# EAGLE design M452sx (EAGLE 6.6.0)
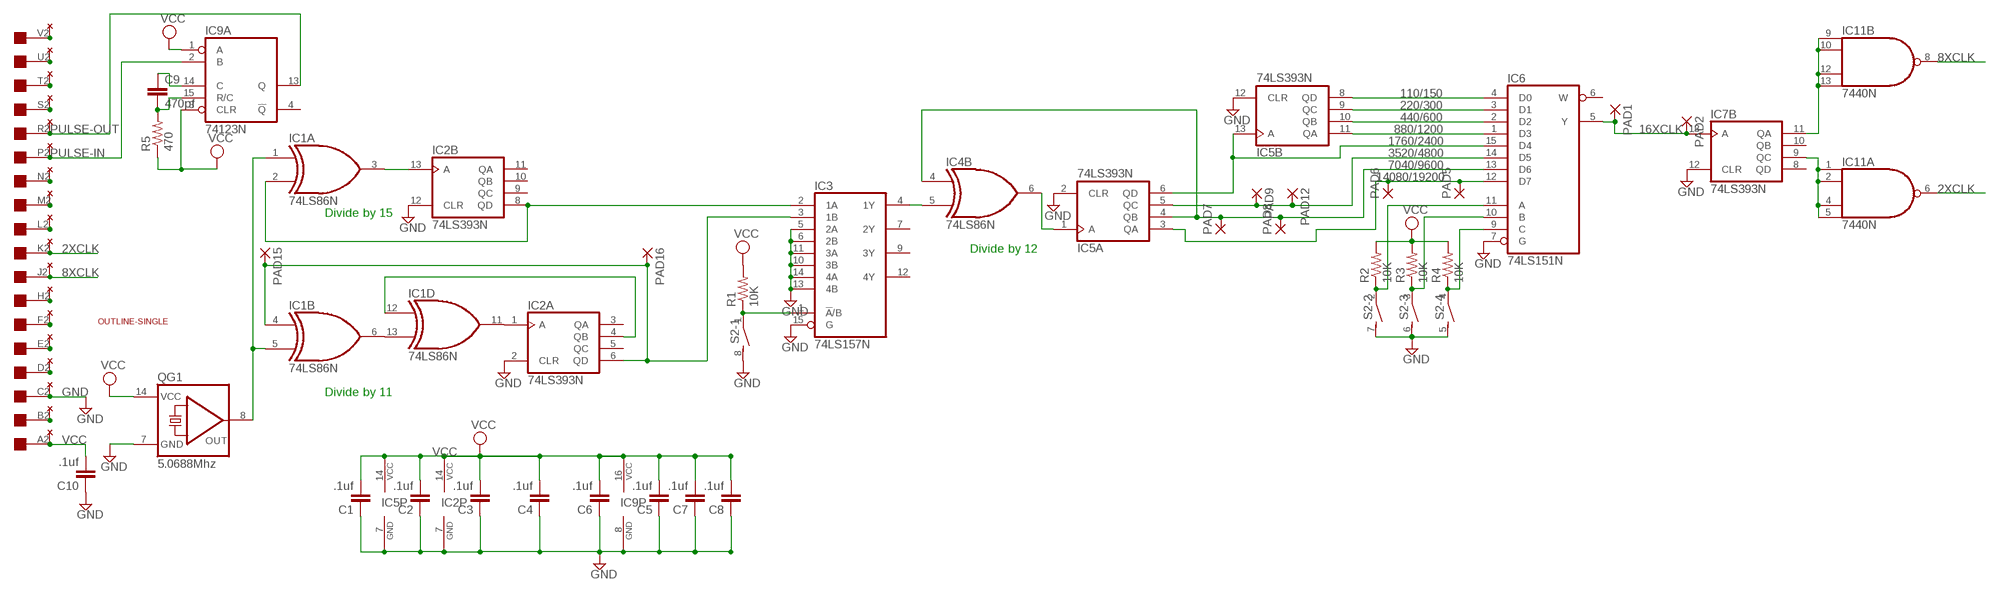
[diagram p0: schematic, sheet 1]

## Parts
C1  .1uf  C-EU050-025X075  [C050-025X075]
C2  .1uf  C-EU050-025X075  [C050-025X075]
C3  .1uf  C-EU050-025X075  [C050-025X075]
C4  .1uf  C-EU050-025X075  [C050-025X075]
C5  .1uf  C-EU050-025X075  [C050-025X075]
C6  .1uf  C-EU050-025X075  [C050-025X075]
C7  .1uf  C-EU050-025X075  [C050-025X075]
C8  .1uf  C-EU050-025X075  [C050-025X075]
C9  470pf  C-EU050-025X075  [C050-025X075]
C10  .1uf  C-EU050-025X075  [C050-025X075]
IC1  74LS86N  [DIL14]
IC2  74LS393N  [DIL14]
IC3  74LS157N  [DIL16]
IC4  74LS86N  [DIL14]
IC5  74LS393N  [DIL14]
IC6  74LS151N  74151N  [DIL16]
IC7  74LS393N  [DIL14]
IC9  74123N  [DIL16]
IC11  7440N  74S20N  [DIL14]
PAD1  1,6/0,8  [1,6/0,8]
PAD2  1,6/0,8  [1,6/0,8]
PAD5  1,6/0,8  [1,6/0,8]
PAD6  1,6/0,8  [1,6/0,8]
PAD7  1,6/0,8  [1,6/0,8]
PAD8  1,6/0,8  [1,6/0,8]
PAD9  1,6/0,8  [1,6/0,8]
PAD12  1,6/0,8  [1,6/0,8]
PAD15  1,6/0,8  [1,6/0,8]
PAD16  1,6/0,8  [1,6/0,8]
QG1  5.0688Mhz  QG5860  [DIL14S]
R1  10K  R-US_0204/7  [0204/7]
R2  10K  R-US_0204/7  [0204/7]
R3  10K  R-US_0204/7  [0204/7]
R4  10K  R-US_0204/7  [0204/7]
R5  470  R-US_0204/7  [0204/7]
S2  DIP04S  [DIP04S]
U$2  EDGE-1  [EDGE-CON1]
U$3  THRU-HOLE1  [THRU-HOLE1]
U$4  OUTLINE-SINGLE  [SINGLE]

## Nets
2XCLK: IC11.6(A:O) U$2.K2 U$3.K2
8XCLK: IC11.8(B:O) U$2.J2 U$3.J2
16XCLK: IC6.5(Y) IC7.13(B:A) PAD1.1(P) PAD2.1(P)
110/150: IC5.8(B:QD) IC6.4(D0)
220/300: IC5.9(B:QC) IC6.3(D1)
440/600: IC5.10(B:QB) IC6.2(D2)
880/1200: IC5.11(B:QA) IC6.1(D3)
1760/2400: IC5.6(A:QD) IC5.13(B:A) IC6.15(D4)
3520/4800: IC5.5(A:QC) IC6.14(D5) PAD9.1(P) PAD12.1(P)
7040/9600: IC4.4(B:I0) IC5.4(A:QB) IC6.13(D6) PAD7.1(P) PAD8.1(P)
14080/19200: IC5.3(A:QA) IC6.12(D7) PAD5.1(P) PAD6.1(P)
GND: C1.1 C2.1 C3.1 C4.1 C5.1 C6.1 C7.1 C8.1 C10.1 IC2.2(A:CLR) IC2.7(P:GND) IC2.12(B:CLR) IC3.5(2A) IC3.6(2B) IC3.10(3B) IC3.11(3A) IC3.13(4B) IC3.14(4A) IC3.15(G) IC5.2(A:CLR) IC5.7(P:GND) IC5.12(B:CLR) IC6.7(G) IC7.12(B:CLR) IC9.8(P:GND) QG1.7(GND) S2.5 S2.6 S2.7 S2.8 U$2.C2 U$3.C2
N$1: IC1.1(A:I0) IC1.5(B:I1) QG1.8(OUT)
N$2: IC1.2(A:I1) IC2.8(B:QD) IC3.2(1A)
N$3: IC1.4(B:I0) IC2.6(A:QD) IC3.3(1B) PAD15.1(P) PAD16.1(P)
N$4: U$2.V2 U$3.V2
N$5: U$2.U2 U$3.U2
N$6: IC1.3(A:O) IC2.13(B:A)
N$7: IC1.11(D:O) IC2.1(A:A)
N$8: IC6.11(A) R2.1 S2.2
N$9: IC3.4(1Y) IC4.5(B:I1)
N$10: IC7.9(B:QC) IC11.1(A:I0) IC11.2(A:I1) IC11.4(A:I2) IC11.5(A:I3)
N$11: IC4.6(B:O) IC5.1(A:A)
N$12: IC7.11(B:QA) IC11.9(B:I0) IC11.10(B:I1) IC11.12(B:I2) IC11.13(B:I3)
N$13: IC6.10(B) R3.1 S2.3
N$14: IC6.9(C) R4.1 S2.4
N$15: IC1.6(B:O) IC1.13(D:I1)
N$16: U$2.T2 U$3.T2
N$17: IC3.1(!A!/B) R1.1 S2.1
N$18: U$2.S2 U$3.S2
N$19: IC1.12(D:I0) IC2.4(A:QB)
N$20: U$2.N2 U$3.N2
N$21: C9.2 IC9.15(A:R/C) R5.2
N$22: C9.1 IC9.14(A:C)
N$23: U$2.M2 U$3.M2
N$24: U$2.L2 U$3.L2
N$25: U$2.H2 U$3.H2
N$26: U$2.F2 U$3.F2
N$27: U$2.E2 U$3.E2
N$28: U$2.D2 U$3.D2
N$29: U$2.B2 U$3.B2
PULSE-IN: IC9.2(A:B) U$2.P2 U$3.P2
PULSE-OUT: IC9.13(A:Q) U$2.R2 U$3.R2
VCC: C1.2 C2.2 C3.2 C4.2 C5.2 C6.2 C7.2 C8.2 C10.2 IC2.14(P:VCC) IC5.14(P:VCC) IC9.1(A:A) IC9.3(A:CLR) IC9.16(P:VCC) QG1.14(VCC) R1.2 R2.2 R3.2 R4.2 R5.1 U$2.A2 U$3.A2
Unconnected: IC1.8(C:O) IC1.9(C:I0) IC1.10(C:I1) IC2.3(A:QA) IC2.5(A:QC) IC2.9(B:QC) IC2.10(B:QB) IC2.11(B:QA) IC3.7(2Y) IC3.9(3Y) IC3.12(4Y) IC4.1(A:I0) IC4.2(A:I1) IC4.3(A:O) IC4.8(C:O) IC4.9(C:I0) IC4.10(C:I1) IC4.11(D:O) IC4.12(D:I0) IC4.13(D:I1) IC6.6(W) IC7.1(A:A) IC7.2(A:CLR) IC7.3(A:QA) IC7.4(A:QB) IC7.5(A:QC) IC7.6(A:QD) IC7.8(B:QD) IC7.10(B:QB) IC9.4(A:!Q) IC9.5(B:Q) IC9.6(B:C) IC9.7(B:R/C) IC9.9(B:A) IC9.10(B:B) IC9.11(B:CLR) IC9.12(B:!Q)

## Notes on the sheet
- Divide by 15
- Divide by 12
- Divide by 11

## Power pins joined to a net without a drawn wire
GND: IC1.7(P:GND) IC3.8(GND) IC4.7(P:GND) IC6.8(GND) IC7.7(P:GND) IC11.7(P:GND)
VCC: IC1.14(P:VCC) IC3.16(VCC) IC4.14(P:VCC) IC6.16(VCC) IC7.14(P:VCC) IC11.14(P:VCC)

## Library data of the parts
C1-C10 = rcl:C-EU: CAPACITOR, European symbol
IC1 IC4 = 74xx-us:74*86: Quad 2-input EXCLUSIV-OR (XOR) gate
IC2 IC5 IC7 = 74xx-us:74*393: Dual 4-bit decade and binary COUNTER
IC3 = 74xx-us:74*157: Quadruple 2-line to 1-line data SELECTOR/MULTIPLEXER
IC6 = 74xx-us:74*151: Data SELECTOR/MULTIPLEXER
IC9 = 74xx-us:74*123: Retriggerable monostable MULTIVIBRATOR
IC11 = 74xx-us:74*20: Dual 4-input NAND gate
PAD1 PAD2 PAD5-PAD9 PAD12 PAD15 PAD16 = wirepad:1,6/0,8: THROUGH-HOLE PAD
QG1 = crystal:QG5860: CRYSTAL RESONATOR; OC_FARNELL: unknown; OC_NEWARK: unknown
R1-R5 = rcl:R-US_: RESISTOR, American symbol
S2 = switch-dil:DIP04S: DIL/CODE SWITCH; OC_FARNELL: unknown; OC_NEWARK: unknown
U$2 = dec-con:EDGE-1: Single-Sided DEC Edge Connector -- (side 2)
U$3 = dec-con:THRU-HOLE1: Thru-Hole addition to double-sided edge connector.
U$4 = dec-con:OUTLINE-*: Board outlines for DEC boards.

## Board
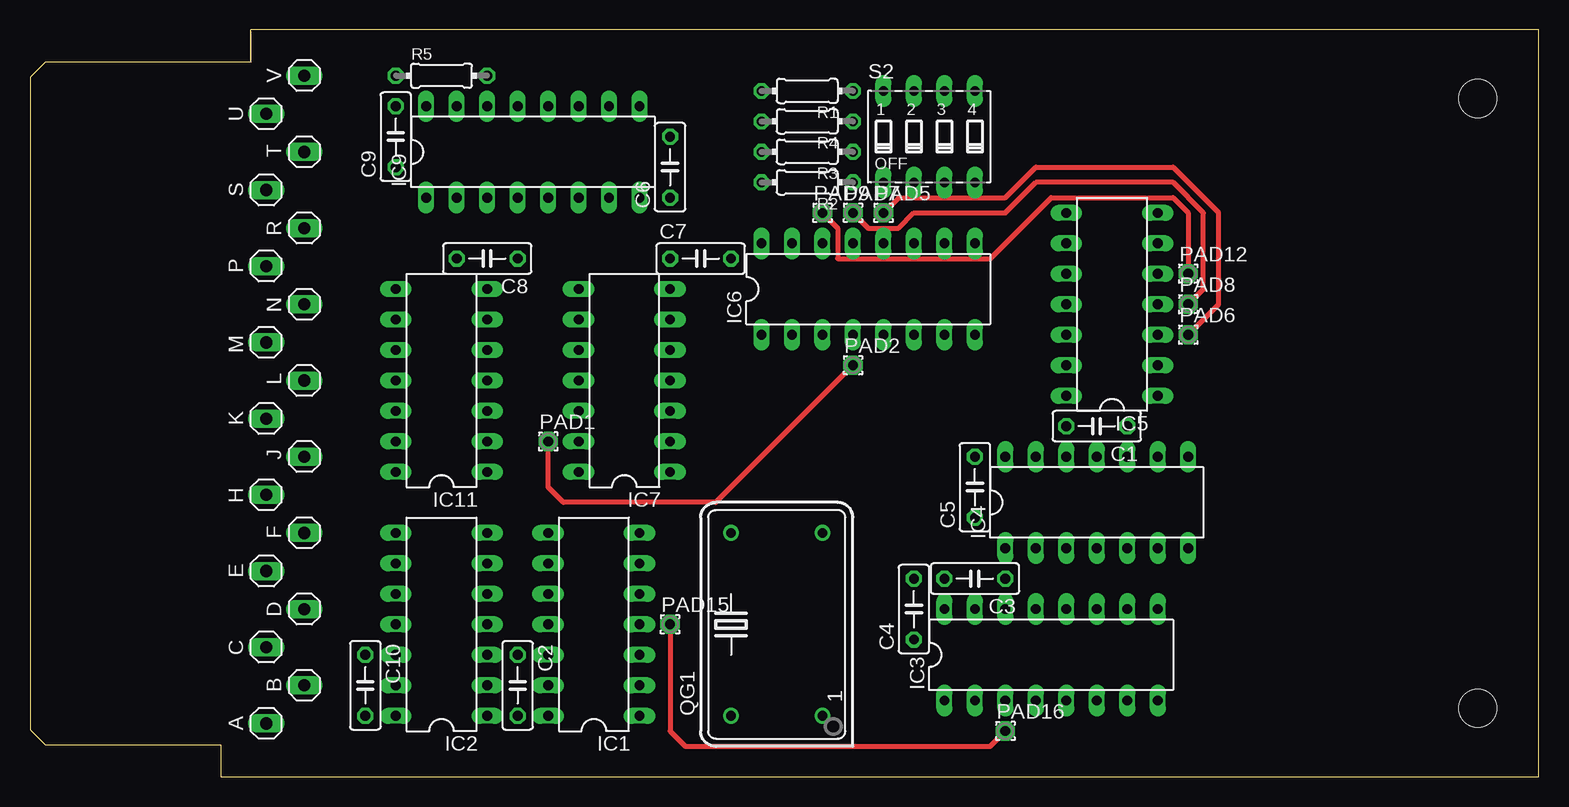
[diagram p1: board, top side]
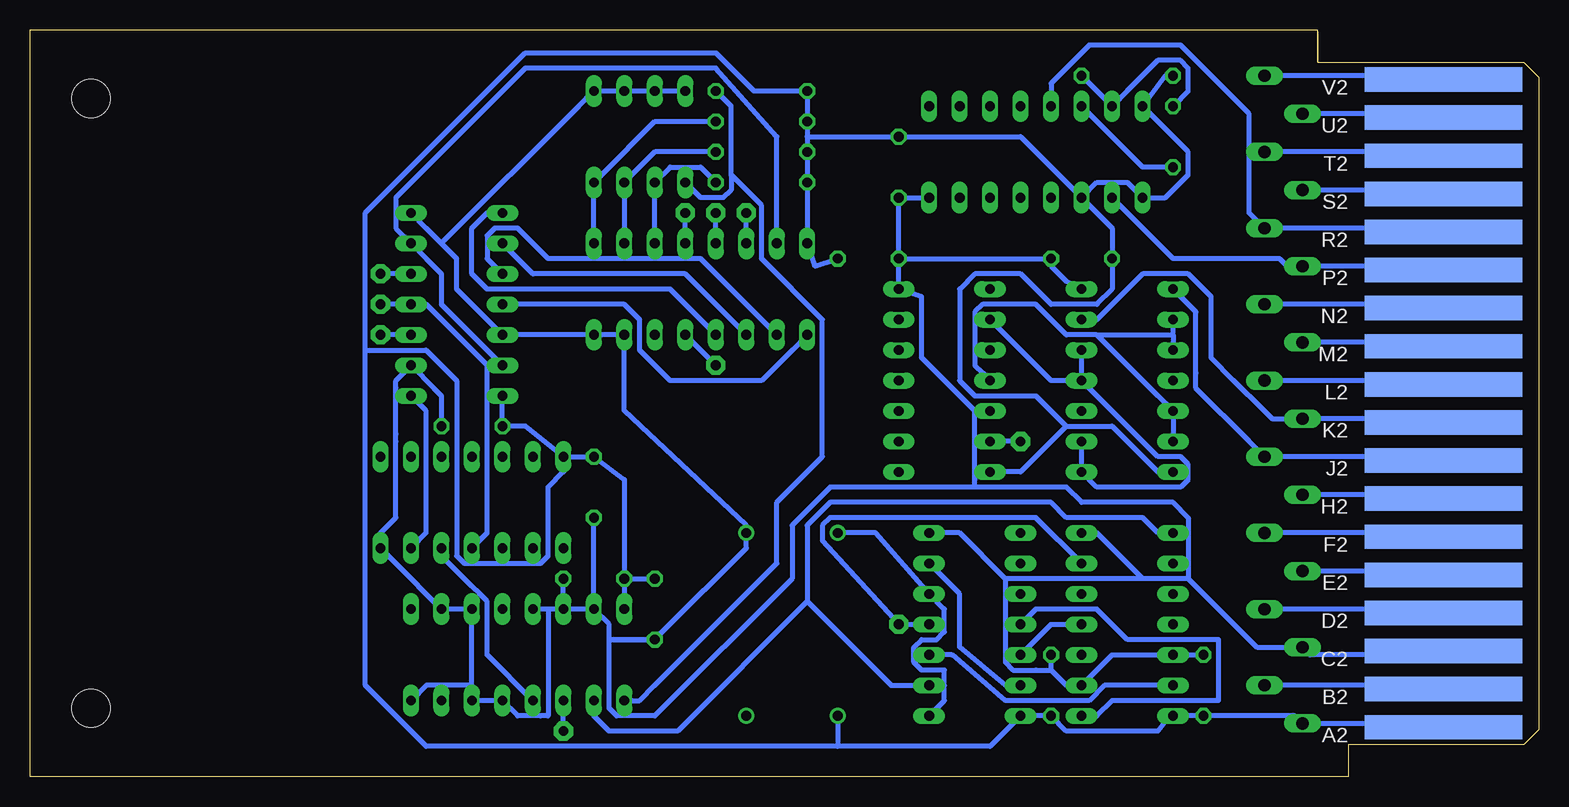
[diagram p2: board, bottom side, seen from below]

Size 125.73 x 62.23 mm. Coordinates in mm from the lower left corner, seen from the top.
Copper layers (1+16): Top 0.035mm / dielectric 1.5mm / Bottom 0.035mm
Design rules "16mils": minimum track width 16mil, minimum drill 32mil, track to track 15mil, track to pad 10mil, pad to pad 10mil, via to via 10mil, smd to smd 10mil, copper to edge 13mil, drill to drill 10mil, minimum pad ring 10mil, minimum via ring 8mil, stop-mask expansion 0mil, vias tented up to drill 0mil, thermal gap 10mil

### Footprints (pad centres in the part's own frame; a part is rotated, then mirrored left to right if it is on the bottom)
C050-025X075 = drill 0.813 octagon: 1 -2.54,0; 2 2.54,0
DIL14 = drill 0.813 long: 1 -7.62,-3.81; 2 -5.08,-3.81; 3 -2.54,-3.81; 4 0,-3.81; 5 2.54,-3.81; 6 5.08,-3.81; 7 7.62,-3.81; 8 7.62,3.81; 9 5.08,3.81; 10 2.54,3.81; 11 0,3.81; 12 -2.54,3.81; 13 -5.08,3.81; 14 -7.62,3.81
DIL16 = drill 0.813 long: 1 -8.89,-3.81; 2 -6.35,-3.81; 3 -3.81,-3.81; 4 -1.27,-3.81; 5 1.27,-3.81; 6 3.81,-3.81; 7 6.35,-3.81; 8 8.89,-3.81; 9 8.89,3.81; 10 6.35,3.81; 11 3.81,3.81; 12 1.27,3.81; 13 -1.27,3.81; 14 -3.81,3.81; 15 -6.35,3.81; 16 -8.89,3.81
1,6/0,8 = drill 0.813 pad 1.6 octagon: 1 0,0
DIL14S = drill 0.813: 1 -7.62,-3.81; 7 7.62,-3.81; 8 7.62,3.81; 14 -7.62,3.81
0204/7 = drill 0.813 octagon: 1 -3.81,0; 2 3.81,0
DIP04S = drill 0.813 long: 1 -3.81,-3.81; 2 -1.27,-3.81; 3 1.27,-3.81; 4 3.81,-3.81; 5 3.81,3.81; 6 1.27,3.81; 7 -1.27,3.81; 8 -3.81,3.81
EDGE-CON1 = smd 13.106 x 2.032 bottom: A2 7.938,4.128; B2 7.938,7.303; C2 7.938,10.477; D2 7.938,13.652; E2 7.938,16.828; F2 7.938,20.003; H2 7.938,23.177; J2 7.938,26.352; K2 7.938,29.527; L2 7.938,32.703; M2 7.938,35.877; N2 7.938,39.053; P2 7.938,42.227; R2 7.938,45.403; S2 7.938,48.578; T2 7.938,51.752; U2 7.938,54.928; V2 7.938,58.102
THRU-HOLE1 = drill 1.016 long: A2 28.575,3.175; B2 25.4,6.35; C2 22.225,3.175; D2 19.05,6.35; E2 15.875,3.175; F2 12.7,6.35; H2 9.525,3.175; J2 6.35,6.35; K2 3.175,3.175; L2 0,6.35; M2 -3.175,3.175; N2 -6.35,6.35; P2 -9.525,3.175; R2 -12.7,6.35; S2 -15.875,3.175; T2 -19.05,6.35; U2 -22.225,3.175; V2 -25.4,6.35
SINGLE = hole 3.175: 120.65,56.515; 120.65,5.715

### Placement (x,y rotation side)
C1  88.9,29.21 180 top
C2  40.64,7.62 270 top
C3  78.74,16.51 180 top
C4  73.66,13.97 90 top
C5  78.74,24.13 90 top
C6  53.34,50.8 90 top
C7  55.88,43.18 0 top
C8  38.1,43.18 180 top
C9  30.48,53.34 90 top
C10  27.94,7.62 270 top
IC1  46.99,12.7 90 top
IC2  34.29,12.7 90 top
IC3  85.09,10.16 0 top
IC4  88.9,22.86 0 top
IC5  90.17,39.37 90 top
IC6  69.85,40.64 0 top
IC7  49.53,33.02 90 top
IC9  41.91,52.07 0 top
IC11  34.29,33.02 90 top
PAD1  43.18,27.94 0 top
PAD2  68.58,34.29 0 top
PAD5  71.12,46.99 0 top
PAD6  96.52,36.83 0 top
PAD7  68.58,46.99 0 top
PAD8  96.52,39.37 0 top
PAD9  66.04,46.99 0 top
PAD12  96.52,41.91 0 top
PAD15  53.34,12.7 0 top
PAD16  81.28,3.81 0 top
QG1  62.23,12.7 90 top
R1  64.77,57.15 180 top
R2  64.77,49.53 180 top
R3  64.77,52.07 180 top
R4  64.77,54.61 180 top
R5  34.29,58.42 0 top
S2  74.93,53.34 0 top
U$2  0,0 0 top
U$3  16.51,33.02 270 top
U$4  0,0 0 top

### Tracks (layer width: path | path; a pad name or v marks a point on that pad's centre or on a via)
2XCLK
  Bottom 0.406: IC11.6 36.83,38.1 33.02,41.91 29.21,41.91 27.31,40.01 27.31,34.92 25.4,33.02 22.86,30.48 22.23,29.84 U$3.K2 8.26,29.84 U$2.K2
8XCLK
  Bottom 0.406: IC11.8 28.58,38.73 28.58,33.66 28.58,32.38 24.13,27.94 U$3.J2 8.26,26.67 U$2.J2
16XCLK
  Top 0.406: PAD2.1 57.15,22.86 44.45,22.86 43.18,24.13 PAD1.1
  Bottom 0.406: PAD1.1 IC7.13 | IC6.5 69.22,34.92 PAD2.1
110/150
  Bottom 0.406: IC6.4 69.85,38.1 72.39,40.64 87.63,40.64 88.9,41.91 88.9,45.72 87.63,46.99 IC5.8
220/300
  Bottom 0.406: IC5.9 83.82,41.91 71.12,41.91 67.31,38.1 IC6.3
440/600
  Bottom 0.406: IC6.2 64.77,38.1 69.85,43.18 82.55,43.18 85.09,45.72 87,45.72 87.63,45.09 87.63,43.18 IC5.10
880/1200
  Bottom 0.406: IC5.11 76.2,39.37 74.93,38.1 74.93,35.56 72.39,33.02 64.77,33.02 62.23,35.56 IC6.1
1760/2400
  Bottom 0.406: IC5.13 91.44,39.37 91.44,40.01 91.44,41.91 92.71,43.18 IC5.6 95.25,45.72 95.25,47.62 95.25,48.26 84.46,59.05 68.58,59.05 63.5,53.34 IC6.15
3520/4800
  Top 0.406: PAD9.1 67.31,45.72 67.31,43.18 80.01,43.18 85.09,48.26 95.25,48.26 96.52,46.99 PAD12.1
  Bottom 0.406: IC6.14 PAD9.1 | IC5.5 PAD12.1
7040/9600
  Top 0.406: PAD8.1 97.79,40.64 97.79,46.99 95.25,49.53 83.82,49.53 81.28,46.99 73.66,46.99 72.39,45.72 69.85,45.72 PAD7.1
  Bottom 0.406: IC4.4 87.63,20.32 87.63,30.48 87.63,31.11 87.63,34.29 92.71,39.37 IC5.4 PAD8.1 | IC6.13 PAD7.1
14080/19200
  Top 0.406: PAD5.1 72.39,48.26 81.28,48.26 83.82,50.8 95.25,50.8 99.06,46.99 99.06,39.37 PAD6.1
  Bottom 0.406: IC6.12 PAD5.1 | IC5.3 PAD6.1
GND
  Bottom 0.406: IC9.8 C6.1 C7.1 | C7.1 IC7.7 51.44,40.01 51.44,34.92 46.99,30.48 | C10.1 IC2.12 35.56,10.16 IC2.2 39.37,7.62 40.64,8.89 | S2.8 71.76,57.15 73.03,57.15 S2.7 74.3,57.15 75.57,57.15 S2.6 76.84,57.15 78.11,57.15 S2.5 80.01,55.88 91.44,44.45 | 91.44,44.45 90.17,43.18 90.17,40.64 IC5.12 IC6.8 78.11,36.83 76.84,36.83 IC6.7 76.2,30.48 66.04,20.95 QG1.7 66.04,19.05 | 91.44,44.45 92.71,45.72 IC5.7 | IC3.14 C3.1 | IC3.15 C5.1 | IC3.14 80.65,13.97 79.38,13.97 IC3.15 | C1.1 91.44,31.75 92.08,32.38 IC5.2 95.25,33.02 95.25,32.38 95.25,28.57 95.25,27.94 95.25,21.59 96.52,20.32 IC4.7 95.25,17.78 IC3.10 90.81,13.97 89.54,13.97 IC3.11 88.9,7.62 | 88.9,7.62 92.71,7.62 IC3.8 | 88.9,7.62 IC3.6 88.27,6.35 87,6.35 IC3.5 85.09,5.08 83.19,5.08 82.55,5.08 82.55,13.97 | 82.55,13.97 81.92,13.97 IC3.14 | 82.55,13.97 83.19,13.97 IC3.13 | IC3.14 82.55,13.97 | C4.1 77.47,11.43 | 77.47,11.43 77.47,12.7 IC3.15 | 46.99,30.48 IC7.12 46.99,30.48 | 66.04,19.05 73.03,12.06 | 73.03,12.06 C4.1 | IC11.7 39.37,41.27 40.64,42.55 C8.1 C7.1 | 29.21,16.51 33.02,16.51 | 33.02,16.51 36.83,20.32 IC2.7 | 44.45,16.51 48.26,20.32 IC1.7 | 33.02,16.51 44.45,16.51 | 40.64,8.89 41.91,8.89 43.82,8.89 44.45,9.53 44.45,16.51 | 40.64,8.89 C2.1 | 46.99,30.48 46.99,24.77 46.99,24.13 | 46.99,24.13 39.37,24.13 38.1,22.86 30.48,22.86 29.21,21.59 29.21,16.51 | 73.03,12.06 66.04,19.05 | C4.1 73.03,12.06 | 77.47,11.43 C4.1 | 77.47,11.43 77.47,7.62 77.47,6.99 77.47,5.71 76.84,5.08 73.66,5.08 62.23,16.51 62.23,20.95 59.06,24.13 46.99,24.13 | U$2.C2 8.26,10.16 19.05,10.16 U$3.C2 23.5,10.79 29.21,16.51
N$1
  Bottom 0.406: IC1.1 49.53,6.35 49.53,7.62 49.53,8.89 51.44,8.89 52.07,9.53 52.07,10.79 51.44,11.43 50.17,11.43 49.53,12.06 49.53,13.97 IC1.5 55.25,20.32 QG1.8
N$2
  Bottom 0.406: 60.96,14.61 60.96,20.95 59.06,22.86 40.64,22.86 39.37,21.59 33.02,21.59 31.75,20.32 IC2.8 | IC3.2 78.74,5.08 77.47,3.81 71.76,3.81 60.96,14.61 | IC1.2 53.98,7.62 60.96,14.61
N$3
  Top 0.406: PAD15.1 53.34,3.81 54.61,2.54 80.01,2.54 PAD16.1
  Bottom 0.406: IC1.4 PAD15.1 59.69,19.68 59.69,20.95 59.06,21.59 41.91,21.59 IC2.6 | PAD16.1 IC3.3
N$4
  Bottom 0.406: U$3.V2 8.26,58.42 U$2.V2
N$5
  Bottom 0.406: U$3.U2 8.26,55.24 U$2.U2
N$6
  Bottom 0.406: IC2.13 36.2,7.62 37.47,6.35 44.45,6.35 48.9,10.16 IC1.3
N$7
  Bottom 0.406: IC1.11 41.91,13.97 36.83,13.97 34.29,11.43 26.67,11.43 26.67,6.35 31.75,6.35 32.39,6.35 34.93,6.35 35.31,6.35 35.56,6.35 36.83,5.08 IC2.1
N$8
  Bottom 0.406: IC6.11 S2.2 72.39,50.8 69.85,50.8 R2.1
N$9
  Bottom 0.406: IC3.4 87.63,10.16 87.63,14.61 88.27,15.24 88.9,15.88 91.44,18.41 IC4.5
N$10
  Bottom 0.406: IC11.2 38.1,27.3 38.1,26.04 IC11.1 36.83,24.13 31.75,24.13 29.85,24.13 29.21,24.77 29.21,26.04 29.85,26.67 31.75,26.67 IC11.4 | IC11.4 38.1,33.66 38.1,34.92 IC11.5 | IC7.9 40.64,33.02 IC11.4
N$11
  Bottom 0.406: IC4.6 92.71,20.32 92.71,25.4 92.71,30.48 IC5.1
N$12
  Bottom 0.406: IC11.13 30.48,28.57 30.48,29.84 IC11.12 31.75,31.75 36.83,36.83 | 30.48,36.83 30.48,37.47 IC11.9 | 30.48,36.83 30.48,36.2 IC11.10 | 36.83,36.83 30.48,36.83 | 36.83,36.83 39.37,36.83 41.91,39.37 46.36,39.37 46.99,38.73 46.99,34.29 46.36,33.66 IC7.11
N$13
  Bottom 0.406: R3.1 73.66,52.07 75.57,50.16 S2.3 IC6.10
N$14
  Bottom 0.406: IC6.9 S2.4 78.11,50.16 73.66,54.61 R4.1
N$15
  Bottom 0.406: IC1.13 44.45,7.62 48.26,10.79 48.26,15.24 IC1.6
N$16
  Bottom 0.406: U$3.T2 8.26,52.07 U$2.T2
N$17
  Bottom 0.406: 67.31,50.16 67.31,55.88 R1.1 | 67.31,50.16 67.31,48.9 67.95,48.26 69.85,48.26 S2.1 | 67.31,50.16 64.77,47.62 64.77,43.18 59.69,38.1 59.69,26.67 60.96,25.4 63.5,22.86 63.5,17.78 73.66,7.62 74.93,6.35 75.57,6.35 IC3.1
N$18
  Bottom 0.406: U$3.S2 8.26,48.9 U$2.S2
N$19
  Bottom 0.406: IC1.12 40.64,12.7 IC2.4
N$20
  Bottom 0.406: U$3.N2 8.26,39.37 U$2.N2
N$21
  Bottom 0.406: C9.2 29.21,57.15 29.21,57.78 29.21,59.05 29.85,59.69 31.75,59.69 34.29,57.15 IC9.15 R5.2
N$22
  Bottom 0.406: C9.1 33.02,50.8 36.83,54.61 IC9.14
N$23
  Bottom 0.406: U$3.M2 8.26,36.2 U$2.M2
N$24
  Bottom 0.406: U$2.L2 8.26,33.02 U$3.L2
N$25
  Bottom 0.406: U$3.H2 8.26,23.5 U$2.H2
N$26
  Bottom 0.406: U$3.F2 8.26,20.32 U$2.F2
N$27
  Bottom 0.406: U$3.E2 8.26,17.14 U$2.E2
N$28
  Bottom 0.406: U$3.D2 8.26,13.97 U$2.D2
N$29
  Bottom 0.406: U$3.B2 8.26,7.62 U$2.B2
PULSE-IN
  Bottom 0.406: IC9.2 34.29,46.99 30.48,43.18 21.59,43.18 20.96,42.55 U$3.P2 8.26,42.55 U$2.P2
PULSE-OUT
  Bottom 0.406: U$2.R2 8.26,45.72 U$3.R2 24.13,46.99 24.13,55.24 29.85,60.96 37.47,60.96 40.64,57.78 IC9.13
VCC
  Bottom 0.406: 58.42,2.54 45.72,2.54 IC1.14 C2.2 39.37,3.81 31.75,3.81 30.73,5.08 IC2.14 C10.2 20.32,5.08 U$3.A2 8.26,4.45 U$2.A2 8.26,3.81 | C3.2 IC3.16 | C3.2 C4.2 | IC4.14 C5.2 76.2,24.77 C3.2 | IC4.14 84.46,29.21 C1.2 IC5.14 | C7.2 60.33,42.55 IC6.16 R2.2 R3.2 60.96,53.34 | 60.96,53.34 C6.2 43.18,53.34 IC9.3 | 60.96,53.34 R4.2 R1.2 65.41,57.15 68.58,60.33 84.46,60.33 97.79,46.99 97.79,35.56 | R5.1 31.12,58.42 IC9.16 29.21,52.07 29.21,50.16 31.12,48.26 IC9.1 34.29,49.53 36.83,49.53 IC9.3 | 97.79,35.56 92.71,35.56 90.17,33.02 90.17,18.41 89.54,17.78 83.19,17.78 82.55,18.41 82.55,24.13 81.28,25.4 IC4.14 | QG1.14 58.42,2.54 | 58.42,2.54 92.71,2.54 97.79,7.62 97.79,35.56 | 39.37,29.21 35.56,29.21 31.75,25.4 IC11.14 | 39.37,29.21 43.18,25.4 IC7.14 | IC9.3 35.56,45.72 C8.2 35.56,40.64 36.83,39.37 40.64,39.37 43.18,41.91 46.99,41.91 48.26,40.64 48.26,33.02 46.99,31.75 41.91,31.75 39.37,29.21